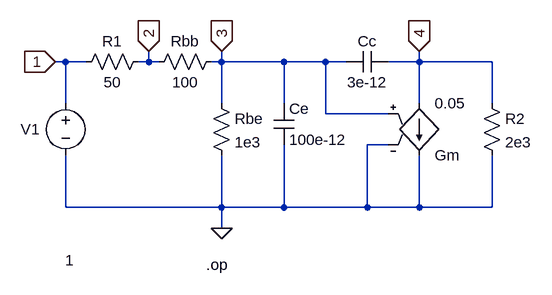
[diagram p0: schematic BJT_CE_amp_small_signal_analysis.asc]
BJT_CE_amp_small_signal_analysis.asc, the LTspice schematic file:
Version 4
SHEET 1 880 680
WIRE 0 80 -16 80
WIRE 32 80 0 80
WIRE 128 80 128 64
WIRE 128 80 112 80
WIRE 144 80 128 80
WIRE 240 80 240 64
WIRE 240 80 224 80
WIRE 336 80 240 80
WIRE 400 80 336 80
WIRE 432 80 400 80
WIRE 544 80 544 64
WIRE 544 80 496 80
WIRE 656 80 544 80
WIRE 0 144 0 80
WIRE 240 144 240 80
WIRE 336 144 336 80
WIRE 544 144 544 80
WIRE 656 144 656 80
WIRE 400 160 400 80
WIRE 496 160 400 160
WIRE 496 208 464 208
WIRE 0 304 0 224
WIRE 240 304 240 224
WIRE 240 304 0 304
WIRE 336 304 336 208
WIRE 336 304 240 304
WIRE 464 304 464 208
WIRE 464 304 336 304
WIRE 544 304 544 224
WIRE 544 304 464 304
WIRE 656 304 656 224
WIRE 656 304 544 304
WIRE 240 336 240 304
FLAG 240 336 0
FLAG -16 80 1
IOPIN -16 80 In
FLAG 128 64 2
IOPIN 128 64 In
FLAG 240 64 3
IOPIN 240 64 In
FLAG 544 64 4
IOPIN 544 64 In
SYMBOL voltage 0 128 R0
WINDOW 0 -69 56 Left 2
WINDOW 3 -1 257 Left 2
SYMATTR InstName V1
SYMATTR Value 1
SYMBOL res 128 64 R90
WINDOW 0 0 56 VBottom 2
WINDOW 3 32 56 VTop 2
SYMATTR InstName R1
SYMATTR Value 50
SYMBOL res 240 64 R90
WINDOW 0 0 56 VBottom 2
WINDOW 3 32 56 VTop 2
SYMATTR InstName Rbb
SYMATTR Value 100
SYMBOL res 224 128 R0
SYMATTR InstName Rbe
SYMATTR Value 1e3
SYMBOL cap 320 144 R0
SYMATTR InstName Ce
SYMATTR Value 100e-12
SYMBOL cap 496 64 R90
WINDOW 0 0 32 VBottom 2
WINDOW 3 32 32 VTop 2
SYMATTR InstName Cc
SYMATTR Value 3e-12
SYMBOL res 640 128 R0
SYMATTR InstName R2
SYMATTR Value 2e3
SYMBOL g2 544 240 M180
SYMATTR InstName Gm
SYMATTR Value 0.05
TEXT 216 392 Left 2 !.op

The netlist it stands for:
* BJT_CE_amp_small_signal_analysis.asc
V1 1 0 1
R1 2 1 50
Rbb 3 2 100
Rbe 3 0 1e3
Ce 3 0 100e-12
Cc 4 3 3e-12
R2 4 0 2e3
Gm 4 0 3 0 0.05
.op
.backanno
.end